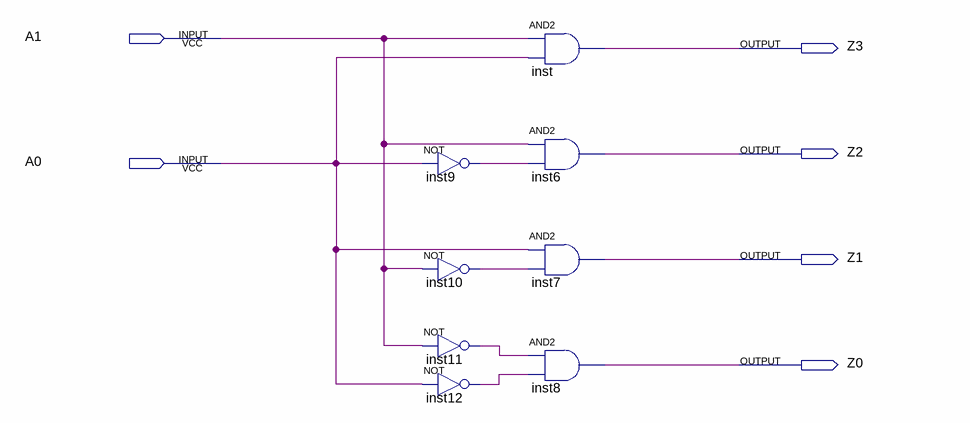
[diagram p0: schematic sheet]
// Quartus schematic 24DECODER.bdf as structural Verilog: 8 symbols, 6 pins
module \24DECODER  (
  input  A1,
  input  A0,
  output Z3,
  output Z2,
  output Z1,
  output Z0
);

  wire inst9_out, inst10_out, inst11_out, inst12_out;

  not inst9 (inst9_out, A0);
  not inst10 (inst10_out, A1);
  not inst11 (inst11_out, A1);
  not inst12 (inst12_out, A0);
  and inst (Z3, A1, A0);
  and inst6 (Z2, A1, inst9_out);
  and inst7 (Z1, A0, inst10_out);
  and inst8 (Z0, inst11_out, inst12_out);
endmodule
